# Altium schematic sheet Pg2 B Terminals & Balancing.SchDoc: EV Kartz Main BMS
size Letter; Organization: Kettering University; Address1: EV Kartz; Address2: Battery Project; Address3: Flint, MI; Address4: United States of America; DocumentNumber: 1; Revision: 1; SheetNumber: 3; SheetTotal: 4
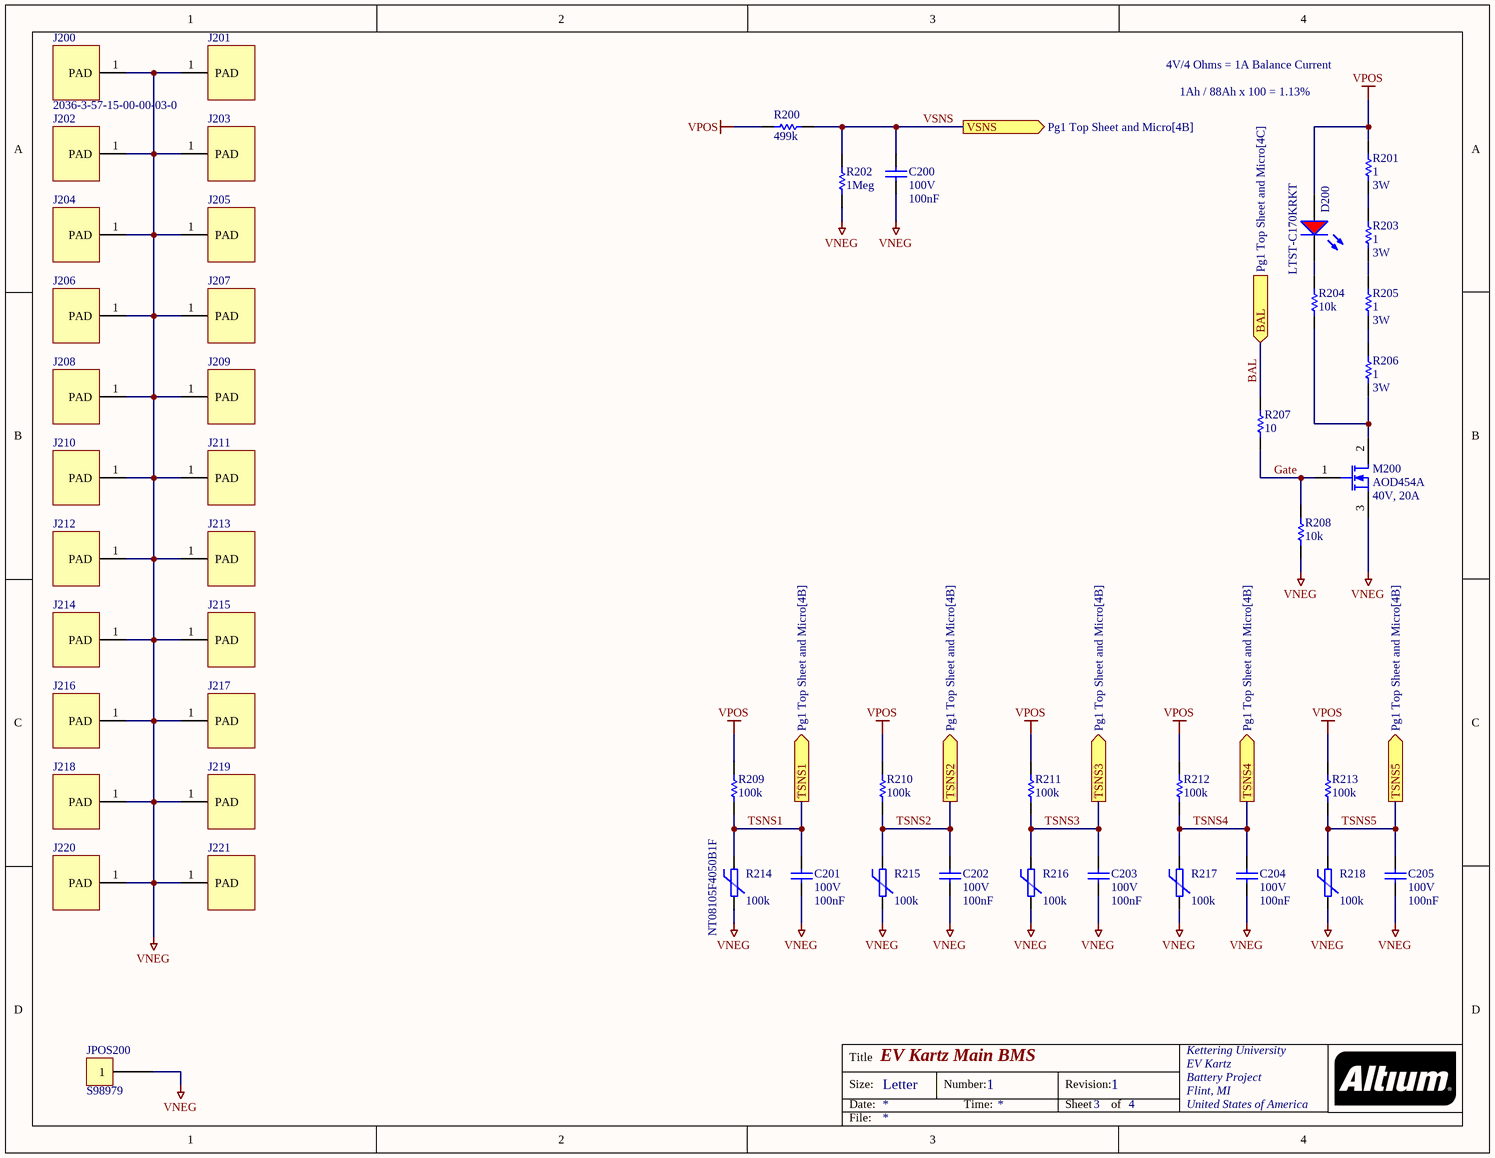
[diagram p0: Pg2 B Terminals & Balancing.SchDoc]

## Parts
C200  value 100nF  Rated: 100V  [CAPC2012N]  (hidden comment: C0805C104K1RACAUTO)
C201  value 100nF  Rated: 100V  [CAPC2012N]  (hidden comment: C0805C104K1RACAUTO)
C202  value 100nF  Rated: 100V  [CAPC2012N]  (hidden comment: C0805C104K1RACAUTO)
C203  value 100nF  Rated: 100V  [CAPC2012N]  (hidden comment: C0805C104K1RACAUTO)
C204  value 100nF  Rated: 100V  [CAPC2012N]  (hidden comment: C0805C104K1RACAUTO)
C205  value 100nF  Rated: 100V  [CAPC2012N]  (hidden comment: C0805C104K1RACAUTO)
D200  LTST-C170KRKT  [DIO2012N-R]
J200  2036-3-57-15-00-00-03-0  [6mm Pad]
J201  2036-3-57-15-00-00-03-0  [6mm Pad]  (value not drawn)
J202  2036-3-57-15-00-00-03-0  [6mm Pad]  (value not drawn)
J203  2036-3-57-15-00-00-03-0  [6mm Pad]  (value not drawn)
J204  2036-3-57-15-00-00-03-0  [6mm Pad]  (value not drawn)
J205  2036-3-57-15-00-00-03-0  [6mm Pad]  (value not drawn)
J206  2036-3-57-15-00-00-03-0  [6mm Pad]  (value not drawn)
J207  2036-3-57-15-00-00-03-0  [6mm Pad]  (value not drawn)
J208  2036-3-57-15-00-00-03-0  [6mm Pad]  (value not drawn)
J209  2036-3-57-15-00-00-03-0  [6mm Pad]  (value not drawn)
J210  2036-3-57-15-00-00-03-0  [6mm Pad]  (value not drawn)
J211  2036-3-57-15-00-00-03-0  [6mm Pad]  (value not drawn)
J212  2036-3-57-15-00-00-03-0  [6mm Pad]  (value not drawn)
J213  2036-3-57-15-00-00-03-0  [6mm Pad]  (value not drawn)
J214  2036-3-57-15-00-00-03-0  [6mm Pad]  (value not drawn)
J215  2036-3-57-15-00-00-03-0  [6mm Pad]  (value not drawn)
J216  2036-3-57-15-00-00-03-0  [6mm Pad]  (value not drawn)
J217  2036-3-57-15-00-00-03-0  [6mm Pad]  (value not drawn)
J218  2036-3-57-15-00-00-03-0  [6mm Pad]  (value not drawn)
J219  2036-3-57-15-00-00-03-0  [6mm Pad]  (value not drawn)
J220  2036-3-57-15-00-00-03-0  [6mm Pad]  (value not drawn)
J221  2036-3-57-15-00-00-03-0  [6mm Pad]  (value not drawn)
JPOS200  S98979  [S98979]
M200  AOD454A  Rated: 40V, 20A  [TO252-3N]
R200  value 499k  [RESC2012N]  (hidden comment: ERJ-6ENF4993V)
R201  value 1  Rated: 3W  [RESC6432N]  (hidden comment: 35221R0JT)
R202  value 1Meg  [RESC2012N]  (hidden comment: ERJ-6ENF1004V)
R203  value 1  Rated: 3W  [RESC6432N]  (hidden comment: 35221R0JT)
R204  value 10k  [RESC2012N]  (hidden comment: ERJ-6ENF1002V)
R205  value 1  Rated: 3W  [RESC6432N]  (hidden comment: 35221R0JT)
R206  value 1  Rated: 3W  [RESC6432N]  (hidden comment: 35221R0JT)
R207  value 10  [RESC2012N]  (hidden comment: ERJ-6ENF10R0V)
R208  value 10k  [RESC2012N]  (hidden comment: ERJ-6ENF1002V)
R209  value 100k  [RESC2012N]  (hidden comment: ERJ-6ENF1003V)
R210  value 100k  [RESC2012N]  (hidden comment: ERJ-6ENF1003V)
R211  value 100k  [RESC2012N]  (hidden comment: ERJ-6ENF1003V)
R212  value 100k  [RESC2012N]  (hidden comment: ERJ-6ENF1003V)
R213  value 100k  [RESC2012N]  (hidden comment: ERJ-6ENF1003V)
R214  NT08105F4050B1F  value 100k  [RESC2012N]
R215  value 100k  [RESC2012N]  (hidden comment: NT08105F4050B1F)
R216  value 100k  [RESC2012N]  (hidden comment: NT08105F4050B1F)
R217  value 100k  [RESC2012N]  (hidden comment: NT08105F4050B1F)
R218  value 100k  [RESC2012N]  (hidden comment: NT08105F4050B1F)

## Ports
BAL (in, see Pg1 Top Sheet and Micro[4C]), TSNS1 (out, see Pg1 Top Sheet and Micro[4B]), TSNS2 (out, see Pg1 Top Sheet and Micro[4B]), TSNS3 (out, see Pg1 Top Sheet and Micro[4B]), TSNS4 (out, see Pg1 Top Sheet and Micro[4B]), TSNS5 (out, see Pg1 Top Sheet and Micro[4B]), VSNS (out, see Pg1 Top Sheet and Micro[4B])

## Nets
VNEG: C200.2 C201.2 C202.2 C203.2 C204.2 C205.2 J200.1(PAD) J201.1(PAD) J202.1(PAD) J203.1(PAD) J204.1(PAD) J205.1(PAD) J206.1(PAD) J207.1(PAD) J208.1(PAD) J209.1(PAD) J210.1(PAD) J211.1(PAD) J212.1(PAD) J213.1(PAD) J214.1(PAD) J215.1(PAD) J216.1(PAD) J217.1(PAD) J218.1(PAD) J219.1(PAD) J220.1(PAD) J221.1(PAD) JPOS200.1 M200.3(S) R202.1 R208.1 R214.2 R215.2 R216.2 R217.2 R218.2
VPOS: D200.1(A) R200.2 R201.2 R209.2 R210.2 R211.2 R212.2 R213.2
BAL: R207.2 ; port BAL
Gate: M200.1(G) R207.1 R208.2
TSNS1: C201.1 R209.1 R214.1 ; port TSNS1
TSNS2: C202.1 R210.1 R215.1 ; port TSNS2
TSNS3: C203.1 R211.1 R216.1 ; port TSNS3
TSNS4: C204.1 R212.1 R217.1 ; port TSNS4
TSNS5: C205.1 R213.1 R218.1 ; port TSNS5
VSNS: C200.1 R200.1 R202.2 ; port VSNS
NetD200_2: D200.2(K) R204.2
NetM200_2: M200.2(D) R204.1 R206.1
NetR201_1: R201.1 R203.2
NetR203_1: R203.1 R205.2
NetR205_1: R205.1 R206.2

## Notes on the sheet
- 4V/4 Ohms = 1A Balance Current
- 1Ah / 88Ah x 100 = 1.13%
- Title
- Size:
- Date:
- Letter
- Number:
- Time:
- Revision:
- Sheet
- of
- File:

## Library data of the parts
C200-C205 = C0805C104K1RACAUTO: Capacitor, Ceramic, 100nF, 100V, 0805, 10%, 125C; Supplier 1: Digi-Key; Supplier Part Number 1: 399-6926-1-ND; Category: C; Tol: 10%; Temp: 125C
D200 = LTST-C170KRKT: LED, SMT 0805, Red, 2.0V, 20mA; Rated: 2.0V, 20mA, 54mcd; Supplier 1: Digi-Key; Supplier Part Number 1: 160-1415-1-ND; Category: D; Value: RED
J200-J221 = 2036-3-57-15-00-00-03-0: Hardware, Sprint Contact Surface; Supplier 1: Digi-Key; Supplier Part Number 1: 54-2036-3-57-15-00-00-03-0CT-ND
JPOS200 = S98979: Screw Terminal M8, 360A
M200 = AOD454A: MOSFET, N-Ch, 40V, 20A, 430mOhm, TO252; Value: 30mOhm @ 10V; Vgs(th): 3.0V; Category: M; Supplier 1: Digi-Key; Supplier Part Number 1: 785-1223-1-ND
R200 = ERJ-6ENF4993V: Resistor, Fixed, 499 kOhm, 0805, 1%, 1/8W; Supplier 1: Digi-Key; Supplier Part Number 1: P499KCCT-ND; Rated: 1/8W; Tol: 1%; Category: R
R201 R203 R205 R206 = 35221R0JT: Resistor, Power, 1 Ohm, 6432, 5%, 3W; Tol: 5%; Category: R; Supplier 1: Digi-Key; Supplier Part Number 1: A121177CT-ND
R202 = ERJ-6ENF1004V: Resistor, Fixed, 1 MOhm, 0805, 1%, 1/8W; Supplier 1: Digi-Key; Supplier Part Number 1: P1.00MCCT-ND; Rated: 1/8W; Tol: 1%; Category: R
R204 R208 = ERJ-6ENF1002V: Resistor, Fixed, 10 kOhm, 0805, 1%, 1/8W; Supplier 1: Digi-Key; Supplier Part Number 1: P10.0KCCT-ND; Rated: 1/8W; Tol: 1%; Category: R
R207 = ERJ-6ENF10R0V: Resistor, Fixed, 10 Ohm, 0805, 1%, 1/8W; Supplier 1: Digi-Key; Supplier Part Number 1: P10.0CCT-ND; Rated: 1/8W; Tol: 1%; Category: R
R209-R213 = ERJ-6ENF1003V: Resistor, Fixed, 100 kOhm, 0805, 1%, 1/8W; Supplier 1: Digi-Key; Supplier Part Number 1: P100KCCT-ND; Rated: 1/8W; Tol: 1%; Category: R
R214-R218 = NTCS0805E3103FMT: Resistor, NTC Thermistor, 100kOhm, 0805, 1%, 125C; Temp: 150C; Rated: 3570K; Tol: 1%; Category: R; Supplier 1: DigiKey; Supplier Part Number 1: 283-NT08105F4050B1FCT-ND